# Altium schematic sheet CAN-Sheet.SchDoc
size 420 x 297 mm; SheetNumber: 6; SheetTotal: 7
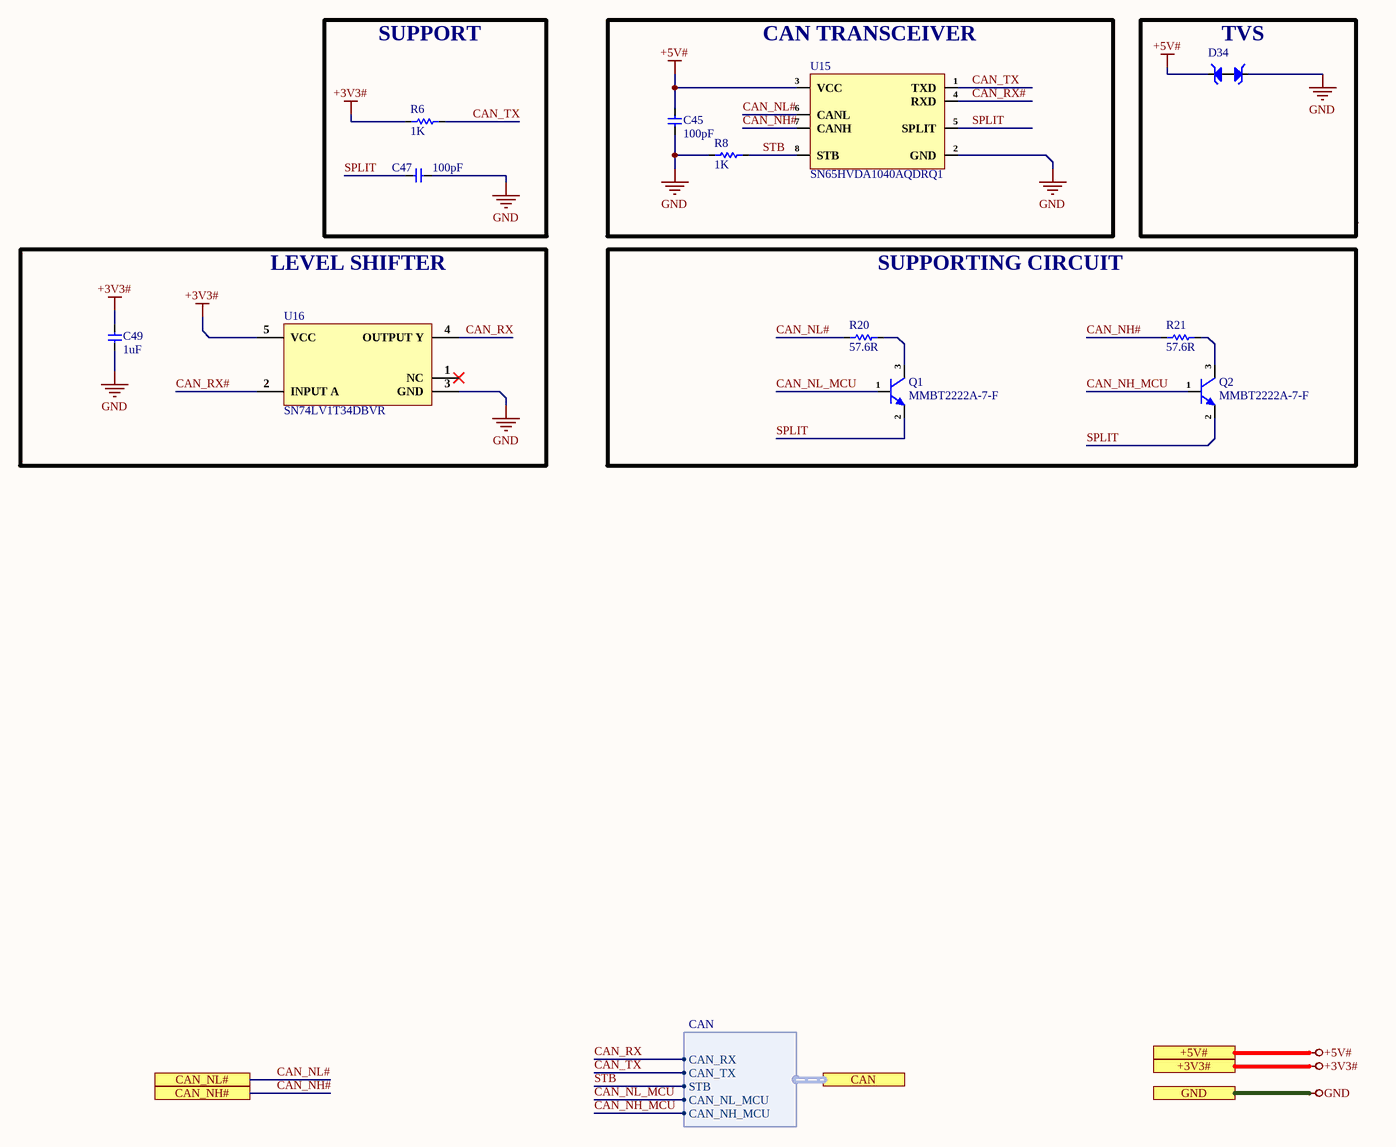
[diagram p0: CAN-Sheet.SchDoc]

## Parts
C45  100pF  [Cap-0402]
C47  100pF  [Cap-0402]
C49  1uF  [Cap-0603]
D34  PESD5V0H1BSFYL  [DSN0603-2]  (value not drawn)
Q1  MMBT2222A-7-F  [SOT-23]
Q2  MMBT2222A-7-F  [SOT-23]
R6  1K  [Res-0402]
R8  1K  [Res-0402]
R20  57.6R  [Res-0402]
R21  57.6R  [Res-0402]
U15  SN65HVDA1040AQDRQ1  [SOIC-8(0.154", 3.90mm Width)]
U16  SN74LV1T34DBVR  [SOT-23-5]

## Blocks framed on the sheet
SUPPORT: C47 R6
CAN TRANSCEIVER: C45 R8 U15
TVS: D34
LEVEL SHIFTER: C49 U16
SUPPORTING CIRCUIT: Q1 Q2 R20 R21

## Ports
+3V3# (see Top-Sheet[3B], Controller-Sheet[5D], Current-Sense-Sheet[5D]), +5V# (see Top-Sheet[3B], Motor-Connector[5D]), CAN (harness CAN, see Top-Sheet[3B], Controller-Sheet[4D]), CAN_NH# (see Top-Sheet[3B], Connector-Sheet[2D]), CAN_NL# (see Top-Sheet[3B], Connector-Sheet[2D]), GND (see Top-Sheet[3B], Connector-Sheet[5D], Controller-Sheet[5D], Current-Sense-Sheet[5D], Motor-Connector[5D], Motor-Driver-Sheet[5D])

## Harnesses
CAN: CAN_RX, CAN_TX, STB, CAN_NL_MCU, CAN_NH_MCU

## Nets
+3V3#: C49.2 R6.1 U16.5(VCC) ; port +3V3#
+5V#: C45.1 D34.2 U15.3(VCC) ; port +5V#
GND: C45.2 C47.1 C49.1 D34.1 R8.1 U15.2(GND) U16.3(GND) ; port GND
CAN_NH#: R21.1 U15.7(CANH) ; port CAN_NH#
CAN_NH_MCU: Q2.1(B) ; port CAN.CAN_NH_MCU
CAN_NL#: R20.1 U15.6(CANL) ; port CAN_NL#
CAN_NL_MCU: Q1.1(B) ; port CAN.CAN_NL_MCU
CAN_RX: U16.4(OUTPUT_Y) ; port CAN.CAN_RX
CAN_RX#: U15.4(RXD) U16.2(INPUT_A)
CAN_TX: R6.2 U15.1(TXD) ; port CAN.CAN_TX
SPLIT: C47.2 Q1.2(E) Q2.2(E) U15.5(SPLIT)
STB: R8.2 U15.8(STB) ; port CAN.STB
NetQ1_3: Q1.3(C) R20.2
NetQ2_3: Q2.3(C) R21.2

Not connected (* = marked no-connect by the designer): U16 1(NC)*

## Notes on the sheet
- File:
- Title:
- Date:
- Page
- Num:
- Total:
- Drawn By: Huzaifa Ali

## Library data of the parts
C45 C47 = CC0402JRNPO9BN101: CAP CER 100PF 50V C0G/NPO 0402; Manufacturer: Yageo; Dielectric Material: Ceramic; Tolerance: 5%; Dielectric: C0G; Temperature Coefficient: 30ppm/°C; Insulation Resistance: 100GR; Item Type: Capacitor; Supplier: Future Electronics; Supplier Part Number: 8934564; Manufacturer Part Number: CC0402JRNPO9BN101; RoHS: Yes; Category: Ceramic Capacitors; Stock: 11720000; Pricing: 10000=0.002, 40000=0.0019, 150000=0.0018, 400000=0.0018, 1000000=0.0017 (USD); Mounting Technology: Surface Mount; Case/Package: 0402; Pins: 2; Case Code (Imperial): 0402; Case Code (Metric): 1005; Min Operating Temperature: -55°C; Max Operating Temperature: 125°C; Value: 100pF; Voltage Rating: 50V; Voltage Rating (DC): 50V; Packaging: Tape and Reel; Package Quantity: 1; Termination: SMD/SMT; Voltage: 50V; Series: CC; Length: 1mm; Width: 0.02inch; Height: 0.5mm; Thickness: 0.022inch; Depth: 0.5mm; Radiation Hardening: No; RoHS Compliant: Yes; Reach SVHC Compliant: No; Lead Free: Lead Free; ComponentLink1URL: https://datasheet.ciiva.com/11786/0900766b80d84fbf-11786101.pdf?src-supplier=Rs; ComponentLink1Description: https://datasheet.ciiva.com/11786/0900766b80d84fbf-11786101.pdf?src-supplier=Rs; ComponentLink2URL: https://datasheet.ciiva.com/23767/25787-23767888.pdf?src-supplier=Newark; ComponentLink2Description: https://datasheet.ciiva.com/23767/25787-23767888.pdf?src-supplier=Newark; ComponentLink3URL: https://datasheet.ciiva.com/28450/1443161-28450220.pdf?src-supplier=Element14; ComponentLink3Description: https://datasheet.ciiva.com/28450/1443161-28450220.pdf?src-supplier=Element14; ComponentLink4URL: https://datasheet.ciiva.com/8033/1443161-8033598.pdf?src-supplier=Element14; ComponentLink4Description: https://datasheet.ciiva.com/8033/1443161-8033598.pdf?src-supplier=Element14; ComponentLink5URL: https://datasheet.ciiva.com/143/mlccorderingcode-143990.pdf?src-supplier=Digi-Key; ComponentLink5Description: https://datasheet.ciiva.com/143/mlccorderingcode-143990.pdf?src-supplier=Digi-Key; ComponentLink6URL: https://datasheet.ciiva.com/143/mlccorderingcode-143989.pdf?src-supplier=Digi-Key; ComponentLink6Description: https://datasheet.ciiva.com/143/mlccorderingcode-143989.pdf?src-supplier=Digi-Key; ComponentLink7URL: https://datasheet.ciiva.com/143/mlccorderingcode-143991.pdf?src-supplier=Digi-Key; ComponentLink7Description: https://datasheet.ciiva.com/143/mlccorderingcode-143991.pdf?src-supplier=Digi-Key; LCSC Part Number: C106200
C49 = CC0603KRX5R8BB105: CAP CER 1UF 25V X5R 0603; Manufacturer: Yageo; Tolerance: 10%; Item Type: Capacitor; Supplier 1: Digi-Key; Manufacturer Part Number: CC0603KRX5R8BB105; RoHS: Yes; Category: Ceramic Capacitors; Stock 1: 919939; Pricing 1: 1=0.12000, 10=0.08400, 50=0.04760, 100=0.03940, 500=0.02764, 1000=0.02288 (USD); Mount: Surface Mount; Case/Package: 0603; Number of Pins: 2; Case Code (Metric): 1608; Case Code (Imperial): 0603; Min Operating Temperature: -55°C; Max Operating Temperature: 85°C; Capacitance: 1uF; Dielectric: X5R; Package Quantity: 1; Voltage Rating: 25V; Packaging: Tape and Reel; Termination: SMD/SMT; Voltage Rating (DC): 25V; Series: CC; Construction: Flat; Length: 1.6mm; Width: 0.031inch; Height: 0.8mm; Thickness: 0.035inch; Depth: 0.8mm; Radiation Hardening: No; REACH SVHC: No SVHC; Lead Free: Lead Free; Halogen Free: Halogen Free; RoHS Compliant: Yes; ComponentLink1URL: https://datasheet.ciiva.com/176/mlccorderingcode-176785.pdf?src-supplier=Digi-Key; ComponentLink1Description: https://datasheet.ciiva.com/176/mlccorderingcode-176785.pdf?src-supplier=Digi-Key; ComponentLink2URL: https://datasheet.ciiva.com/176/mlccorderingcode-176786.pdf?src-supplier=Digi-Key; ComponentLink2Description: https://datasheet.ciiva.com/176/mlccorderingcode-176786.pdf?src-supplier=Digi-Key; ComponentLink3URL: https://datasheet.ciiva.com/176/mlccorderingcode-176787.pdf?src-supplier=Digi-Key; ComponentLink3Description: https://datasheet.ciiva.com/176/mlccorderingcode-176787.pdf?src-supplier=Digi-Key; ComponentLink4URL: https://datasheet.ciiva.com/17436/upy-gphc-x5r-4v-to-50v-12-17436952.pdf?src-supplier=Avnet+Europe; ComponentLink4Description: https://datasheet.ciiva.com/17436/upy-gphc-x5r-4v-to-50v-12-17436952.pdf?src-supplier=Avnet+Europe; ComponentLink5URL: https://datasheet.ciiva.com/7978/1525783-7978171.pdf?src-supplier=Element14; ComponentLink5Description: https://datasheet.ciiva.com/7978/1525783-7978171.pdf?src-supplier=Element14; ComponentLink6URL: https://datasheet.ciiva.com/11586/upy-gphc-x5r-4v-to-50v-12-11586318.pdf?src-supplier=Avnet; ComponentLink6Description: https://datasheet.ciiva.com/11586/upy-gphc-x5r-4v-to-50v-12-11586318.pdf?src-supplier=Avnet; Supplier Part Number 1: 311-1445-1-ND; LCSC Part Number: C14664
D34 = PESD5V0H1BSFYL: TVS DIODE 5VWM 6.3VC DSN0603-2; Manufacturer: Nexperia; Supplier 1: Avnet; Manufacturer Part Number: PESD5V0H1BSFYL; RoHS: Yes; Category: ESD and Circuit Protection ICs; Stock 1: 9000; Pricing 1: 18000=0.06453, 36000=0.06278, 54000=0.06104, 90000=0.05930, 180000=0.05755, 900000=0.05581, 1800000=0.05406 (USD); RoHS Compliant: Yes; ComponentLink1URL: http://www.farnell.com/datasheets/1961312.pdf?src-supplier=Farnell; ComponentLink1Description: http://www.farnell.com/datasheets/1961312.pdf?src-supplier=Farnell; ComponentLink2URL: https://assets.nexperia.com/documents/data-sheet/PESD5V0H1BSF.pdf?src-supplier=Digi-Key; ComponentLink2Description: https://assets.nexperia.com/documents/data-sheet/PESD5V0H1BSF.pdf?src-supplier=Digi-Key; ComponentLink3URL: http://www.farnell.com/datasheets/1961312.pdf?src-supplier=Newark; ComponentLink3Description: http://www.farnell.com/datasheets/1961312.pdf?src-supplier=Newark; Supplier Part Number 1: PESD5V0H1BSFYL; LCSC Part Number: C477989; Item Type: Diode
Q1 Q2 = MMBT2222A-7-F: TRANS NPN 40V 0.6A SMD SOT23-3; Manufacturer: Diodes; Max Power Dissipation: 300mW; Collector Base Voltage (VCBO): 75V; Max Collector Current: 600mA; hFE Min: 100; Frequency: 300MHz; Number of Elements: 1; Emitter Base Voltage (VEBO): 6V; Collector Emitter Saturation Voltage: 1V; Power Dissipation: 350mW; Element Configuration: Single; Current: 1A; Item Type: Mosfet; Supplier 1: Digi-Key; Manufacturer Part Number: MMBT2222A-7-F; Stock 1: 2471182; Pricing 1: 1=0.15, 10=0.134, 100=0.0729, 500=0.04486, 1000=0.03059 (USD); Mount: Surface Mount; Case/Package: SOT-23; Number of Pins: 3; Weight: 0.000282oz; Contact Plating: Matte,Tin; Min Operating Temperature: -55°C; Max Operating Temperature: 150°C; Packaging: Tape and Reel; Collector Emitter Voltage (VCEO): 40V; Polarity: NPN; Voltage Rating (DC): 40V; Package Quantity: 3000; Continuous Collector Current: 600mA; Collector Emitter Breakdown Voltage: 40V; Transition Frequency: 300MHz; Max Breakdown Voltage: 40V; Max Frequency: 300MHz; Termination: SMD/SMT; Gain Bandwidth Product: 300MHz; Current Rating: 600mA; Voltage: 40V; Length: 3.05mm; Height: 1mm; Width: 1.4mm; Radiation Hardening: No; Lead Free: Lead Free; REACH SVHC: No SVHC; ComponentLink1URL: http://www.diodes.com/datasheets/ds30041.pdf?src-supplier=Future+Electronics; ComponentLink1Description: http://www.diodes.com/datasheets/ds30041.pdf?src-supplier=Future+Electronics; ComponentLink2URL: http://www.diodes.com/datasheets/ds30041.pdf?src-supplier=Avnet; ComponentLink2Description: http://www.diodes.com/datasheets/ds30041.pdf?src-supplier=Avnet; ComponentLink3URL: https://www.verical.com/server-webapp/html/getDatasheet?partID=82692&src-supplier=Verical; ComponentLink3Description: https://www.verical.com/server-webapp/html/getDatasheet?partID=82692&src-supplier=Verical; ComponentLink4URL: https://www.diodes.com/assets/Datasheets/ds30041.pdf?src-supplier=Digi-Key; ComponentLink4Description: https://www.diodes.com/assets/Datasheets/ds30041.pdf?src-supplier=Digi-Key; ComponentLink5URL: http://www.diodes.com/datasheets/ds30041.pdf?src-supplier=Avnet+Europe; ComponentLink5Description: http://www.diodes.com/datasheets/ds30041.pdf?src-supplier=Avnet+Europe; ComponentLink6URL: http://www.diodes.com/datasheets/ds30041.pdf?src-supplier=Element14; ComponentLink6Description: http://www.diodes.com/datasheets/ds30041.pdf?src-supplier=Element14; Supplier Part Number 1: MMBT2222A-FDIDKR-ND; LCSC Part Number: C94515
R6 = RC0402FR-071KL: RES 1K OHM 1% 1/16W 0402; Manufacturer: Yageo; Resistance: 1kR; Temperature Coefficient: 100ppm/°C; Voltage Rating (DC): 50V; Power Rating: 62.5mW; Max Power Dissipation: 63mW; Item Type: Resistor; Supplier 1: Avnet; Manufacturer Part Number: RC0402FR-071KL; RoHS: Yes; Category: Chip SMD Resistors; Stock 1: 13030000; Pricing 1: 10000=0.00085, 20000=0.00087, 40000=0.00084, 60000=0.00083, 80000=0.00079, 100000=0.00078, 1000000=0.00076 (USD); Case/Package: 0402; Number of Pins: 2; Case Code (Imperial): 0402; Case Code (Metric): 1005; Size Code: 0402; Min Operating Temperature: -55°C; Max Operating Temperature: 155°C; Resistor Type: Thick Film; Tolerance: 1%; Packaging: Tape and Reel; Voltage Rating: 50V; Termination: SMD/SMT; Features: Moisture Resistant; Series: RC; Number of Terminations: 2; Resistance Tolerance: 1%; Construction: Rectangular; Technology: THICK FILM; Length: 1mm; Width: 0.5mm; Height: 0.32mm; Depth: 0.5mm; Reach SVHC Compliant: Yes; Lead Free: Lead Free; RoHS Compliant: Yes; Military Standard: Not; ComponentLink1URL: https://datasheet.ciiva.com/11819/0900766b80c66297-11819477.pdf?src-supplier=RSComponents; ComponentLink1Description: https://datasheet.ciiva.com/11819/0900766b80c66297-11819477.pdf?src-supplier=RSComponents; ComponentLink2URL: https://datasheet.ciiva.com/7983/1018594-7983502.pdf?src-supplier=Element14; ComponentLink2Description: https://datasheet.ciiva.com/7983/1018594-7983502.pdf?src-supplier=Element14; ComponentLink3URL: https://datasheet.ciiva.com/22747/1018594-22747513.pdf?src-supplier=Element14; ComponentLink3Description: https://datasheet.ciiva.com/22747/1018594-22747513.pdf?src-supplier=Element14; ComponentLink4URL: https://datasheet.ciiva.com/12666/pyu-rc0402-51-rohs-l-6-r-12666741.pdf?src-supplier=Mouser; ComponentLink4Description: https://datasheet.ciiva.com/12666/pyu-rc0402-51-rohs-l-6-r-12666741.pdf?src-supplier=Mouser; ComponentLink5URL: https://datasheet.ciiva.com/7849/1018594-7849869.pdf?src-supplier=Element14; ComponentLink5Description: https://datasheet.ciiva.com/7849/1018594-7849869.pdf?src-supplier=Element14; ComponentLink6URL: https://datasheet.ciiva.com/7849/1018594-7849871.pdf?src-supplier=Element14; ComponentLink6Description: https://datasheet.ciiva.com/7849/1018594-7849871.pdf?src-supplier=Element14; ComponentLink7URL: https://datasheet.ciiva.com/17063/pyu-rc0402-51-rohs-l-6-r-17063193.pdf?src-supplier=Future+Electronics; ComponentLink7Description: https://datasheet.ciiva.com/17063/pyu-rc0402-51-rohs-l-6-r-17063193.pdf?src-supplier=Future+Electronics; Supplier Part Number 1: RC0402FR-071KL; LCSC Part Number: C106235
R8 = CRCW04021K00FKEDHP: RES SMD 1K OHM 1% 1/5W 0402; Manufacturer: Vishay Dale; Resistance: 1kR; Temperature Coefficient: 100ppm/°C; Power Rating: 125mW; Voltage Rating: 50V; Supplier 1: Digi-Key; Manufacturer Part Number: CRCW04021K00FKEDHP; Stock 1: 315989; Pricing 1: 1=0.15, 10=0.132, 100=0.0506, 1000=0.02226, 2500=0.01923, 5000=0.0172 (USD); Mount: Surface Mount; Case/Package: 0402; Number of Pins: 2; Contact Plating: Tin; Weight: 2.3E-05oz; Case Code (Imperial): 0402; Case Code (Metric): 1005; Size Code: 0402; Min Operating Temperature: -55°C; Max Operating Temperature: 155°C; Tolerance: 1%; Resistor Type: Thick Film; Package Quantity: 10; Packaging: Tape and Reel; Number of Terminations: 2; Termination: SMD/SMT; Max Power Dissipation: 125mW; Voltage Rating (DC): 50V; Features: Automotive AEC-Q200; Series: CRCW-HP; Construction: Rectangular; Technology: THICK FILM; Resistance Tolerance: 1%; Length: 1mm; Width: 0.5mm; Height: 0.3mm; Depth: 0.5mm; Radiation Hardening: No; REACH SVHC: Unknown; Military Standard: Not; Lead Free: Lead Free; RoHS Compliant: Yes; ComponentLink1URL: http://www.farnell.com/datasheets/2339608.pdf?src-supplier=Element14; ComponentLink1Description: http://www.farnell.com/datasheets/2339608.pdf?src-supplier=Element14; ComponentLink2URL: http://www.vishay.com/docs/20043/crcwhpe3.pdf?src-supplier=Digi-Key; ComponentLink2Description: http://www.vishay.com/docs/20043/crcwhpe3.pdf?src-supplier=Digi-Key; ComponentLink3URL: http://www.mouser.com/ds/2/427/crcwhpe3-46056.pdf?src-supplier=Mouser; ComponentLink3Description: http://www.mouser.com/ds/2/427/crcwhpe3-46056.pdf?src-supplier=Mouser; ComponentLink4URL: http://www.vishay.com/docs/20043/crcwhpe3.pdf?src-supplier=Avnet; ComponentLink4Description: http://www.vishay.com/docs/20043/crcwhpe3.pdf?src-supplier=Avnet; ComponentLink5URL: http://www.vishay.com/docs/20043/crcwhpe3.pdf?src-supplier=Future+Electronics; ComponentLink5Description: http://www.vishay.com/docs/20043/crcwhpe3.pdf?src-supplier=Future+Electronics; Supplier Part Number 1: 541-1.00KYCT-ND; LCSC Part Number: C313354
R20 R21 = ERJ-2RKF57R6X: RES SMD 57.6 OHM 1% 1/10W 0402; Manufacturer: Panasonic; Item Type: Resistors; Supplier: Mouser; Supplier Part Number: 667-ERJ-2RKF57R6X; Manufacturer Part Number: ERJ-2RKF57R6X; RoHS: Yes; Stock: 32931; Pricing: 1=0.1, 10=0.015, 50=0.015, 100=0.009, 1000=0.006, 10000=0.003 (USD); ComponentLink1URL: https://datasheet.ciiva.com/9188/aoa0000ce2-9188571.pdf?src-supplier=Avnet; ComponentLink1Description: https://datasheet.ciiva.com/9188/aoa0000ce2-9188571.pdf?src-supplier=Avnet; ComponentLink2URL: https://datasheet.ciiva.com/9188/aoa0000ce2-9188574.pdf?src-supplier=Avnet; ComponentLink2Description: https://datasheet.ciiva.com/9188/aoa0000ce2-9188574.pdf?src-supplier=Avnet; ComponentLink3URL: https://datasheet.ciiva.com/24026/aoa0000ce2-24026248.pdf?src-supplier=Mouser; ComponentLink3Description: https://datasheet.ciiva.com/24026/aoa0000ce2-24026248.pdf?src-supplier=Mouser; ComponentLink4URL: https://datasheet.ciiva.com/43467/1678782-43467198.pdf?src-supplier=Farnell; ComponentLink4Description: https://datasheet.ciiva.com/43467/1678782-43467198.pdf?src-supplier=Farnell; ComponentLink5URL: https://datasheet.ciiva.com/46372/1678782-46372935.pdf?src-supplier=Element14; ComponentLink5Description: https://datasheet.ciiva.com/46372/1678782-46372935.pdf?src-supplier=Element14; ComponentLink6URL: https://datasheet.ciiva.com/46372/1678782-46372936.pdf?src-supplier=Element14; ComponentLink6Description: https://datasheet.ciiva.com/46372/1678782-46372936.pdf?src-supplier=Element14; ComponentLink7URL: https://datasheet.ciiva.com/22668/1678782-22668391.pdf?src-supplier=Element14; ComponentLink7Description: https://datasheet.ciiva.com/22668/1678782-22668391.pdf?src-supplier=Element14; ComponentLink8URL: https://datasheet.ciiva.com/22743/1678782-22743894.pdf?src-supplier=Element14; ComponentLink8Description: https://datasheet.ciiva.com/22743/1678782-22743894.pdf?src-supplier=Element14; ComponentLink9URL: https://datasheet.ciiva.com/30107/aoa0000ce2-30107676.pdf?src-supplier=Onlinecomponents.com; ComponentLink9Description: https://datasheet.ciiva.com/30107/aoa0000ce2-30107676.pdf?src-supplier=Onlinecomponents.com; LCSC Part Number: C3025671
U15 = SN65HVDA1040AQDRQ1: IC TRANSCEIVER HALF 1/1 8SOIC; Manufacturer: Texas Instruments; Supplier: Mouser; LCSC Part Number: C188675; Manufacturer Part Number: SN65HVDA1040AQDRQ1; RoHS: Yes; Item Type: IC; Stock: 5009; Pricing: 1=2.2, 10=1.87, 50=1.87, 100=1.59, 1000=1.08, 10000=0.971 (USD); ComponentLink1URL: https://datasheet.ciiva.com/28652/1787993-28652354.pdf?src-supplier=Element14; ComponentLink1Description: https://datasheet.ciiva.com/28652/1787993-28652354.pdf?src-supplier=Element14; ComponentLink2URL: https://datasheet.ciiva.com/41461/001187135-da-01-en-ic-transcv-sn65hvda1040aqdrq1-soic-8-tid-41461891.pdf?src-supplier=Conrad; ComponentLink2Description: https://datasheet.ciiva.com/41461/001187135-da-01-en-ic-transcv-sn65hvda1040aqdrq1-soic-8-tid-41461891.pdf?src-supplier=Conrad; ComponentLink3URL: https://datasheet.ciiva.com/15150/getdatasheetpartid-184324-15150727.pdf?src-supplier=Verical; ComponentLink3Description: https://datasheet.ciiva.com/15150/getdatasheetpartid-184324-15150727.pdf?src-supplier=Verical; ComponentLink4URL: https://datasheet.ciiva.com/1766/sn65hvda1040a-q1-1766438.pdf?src-supplier=Digikey; ComponentLink4Description: https://datasheet.ciiva.com/1766/sn65hvda1040a-q1-1766438.pdf?src-supplier=Digikey; ComponentLink5URL: https://datasheet.ciiva.com/1766/sn65hvda1040a-q1-1766439.pdf?src-supplier=Digikey; ComponentLink5Description: https://datasheet.ciiva.com/1766/sn65hvda1040a-q1-1766439.pdf?src-supplier=Digikey; ComponentLink6URL: https://datasheet.ciiva.com/1766/sn65hvda1040a-q1-1766440.pdf?src-supplier=Digikey; ComponentLink6Description: https://datasheet.ciiva.com/1766/sn65hvda1040a-q1-1766440.pdf?src-supplier=Digikey
U16 = SN74LV1T34DBVR: IC BUF NON-INVERT 5.5V SOT23-5; Manufacturer: Texas Instruments; Number of Elements: 1; Logic Function: Buffer,Inverting; High Level Output Current: -8mA; Low Level Output Current: 8mA; Min Supply Voltage: 1.6V; Polarity: Non-Inverting; Propagation Delay: 15.5ns; Quiescent Current: 1uA; Supplier 1: Digi-Key; Manufacturer Part Number: SN74LV1T34DBVR; Stock 1: 37360; Pricing 1: 1=0.43, 10=0.349, 25=0.3192, 100=0.2374, 250=0.2152, 500=0.17808, 1000=0.13356 (USD); Mount: Surface Mount; Case/Package: SOT-23-5; Number of Pins: 5; Weight: 0.000353oz; Min Operating Temperature: -40°C; Max Operating Temperature: 125°C; Packaging: Tape and Reel; Number of Bits per Element: 1; Number of Bits: 1; Package Quantity: 3000; Max Supply Voltage: 5.5V; Number of Input Lines: 1; Number of Output Lines: 1; Operating Supply Current: 8mA; Number of Channels: 1; Number of Inputs: 1; Number of Outputs: 1; Radiation Hardening: No; RoHS Compliant: Yes; REACH SVHC: No SVHC; Lead Free: Lead Free; ComponentLink1URL: http://www.ti.com/lit/pdf/sdyu001?src-supplier=Digi-Key; ComponentLink1Description: http://www.ti.com/lit/pdf/sdyu001?src-supplier=Digi-Key; ComponentLink2URL: http://www.ti.com/lit/ds/symlink/sn74lv1t34.pdf?src-supplier=Avnet; ComponentLink2Description: http://www.ti.com/lit/ds/symlink/sn74lv1t34.pdf?src-supplier=Avnet; Supplier Part Number 1: 296-37176-6-ND; LCSC Part Number: C100024; Item Type: IC